# EAGLE design FootVibrator (EAGLE 9.5.1)

## Sheet 1 of 5: VL53L0X and Peripherals
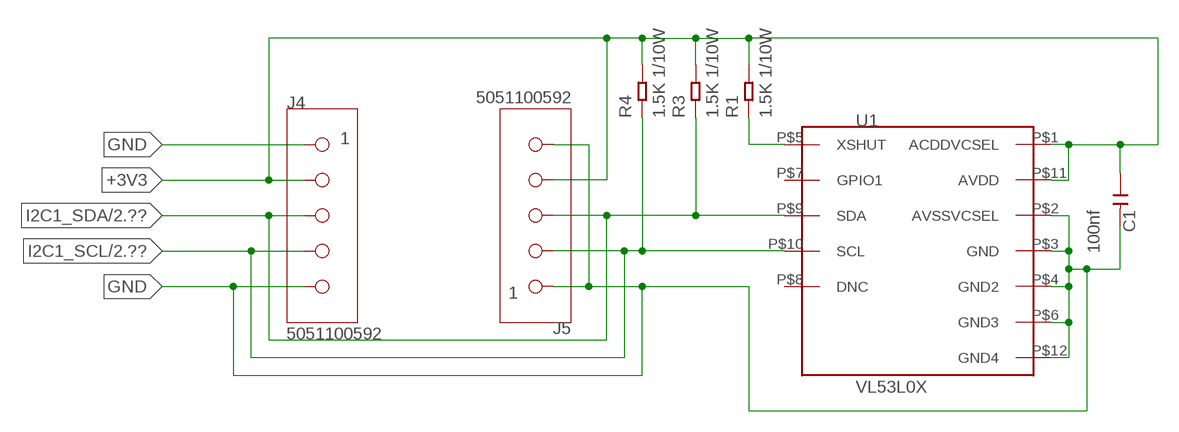
[diagram p0: schematic, sheet 1]

### Parts
C1  100nf  CERAMIC-100NF-50V-10%-X7R(0603)  [C0603]
J4  5051100592  [5051100592]
J5  5051100592  [5051100592]
R1  1.5K 1/10W  SMD-RES-1.5K-5%-1/10W(0603)  [R0603]
R3  1.5K 1/10W  SMD-RES-1.5K-5%-1/10W(0603)  [R0603]
R4  1.5K 1/10W  SMD-RES-1.5K-5%-1/10W(0603)  [R0603]
U1  VL53L0X  [VL53L0X]

### Nets
+3V3: C1.1 J4.2 J5.4 R1.2 R3.2 R4.2 U1.P$1(ACDDVCSEL) U1.P$11(AVDD) ; also sheet 2,3,4,5
GND: C1.2 J4.1 J4.5 J5.1 J5.5 U1.P$2(AVSSVCSEL) U1.P$3(GND) U1.P$4(GND2) U1.P$6(GND3) U1.P$12(GND4) ; also sheet 2,3,4,5
I2C1_SCL: J4.4 J5.2 R4.1 U1.P$10(SCL) ; also sheet 2
I2C1_SDA: J4.3 J5.3 R3.1 U1.P$9(SDA) ; also sheet 2
VL_XSHUT: R1.1 U1.P$5(XSHUT)
Unconnected: U1.P$7(GPIO1) U1.P$8(DNC)

## Sheet 2 of 5: STM32L010K8 and peripherals
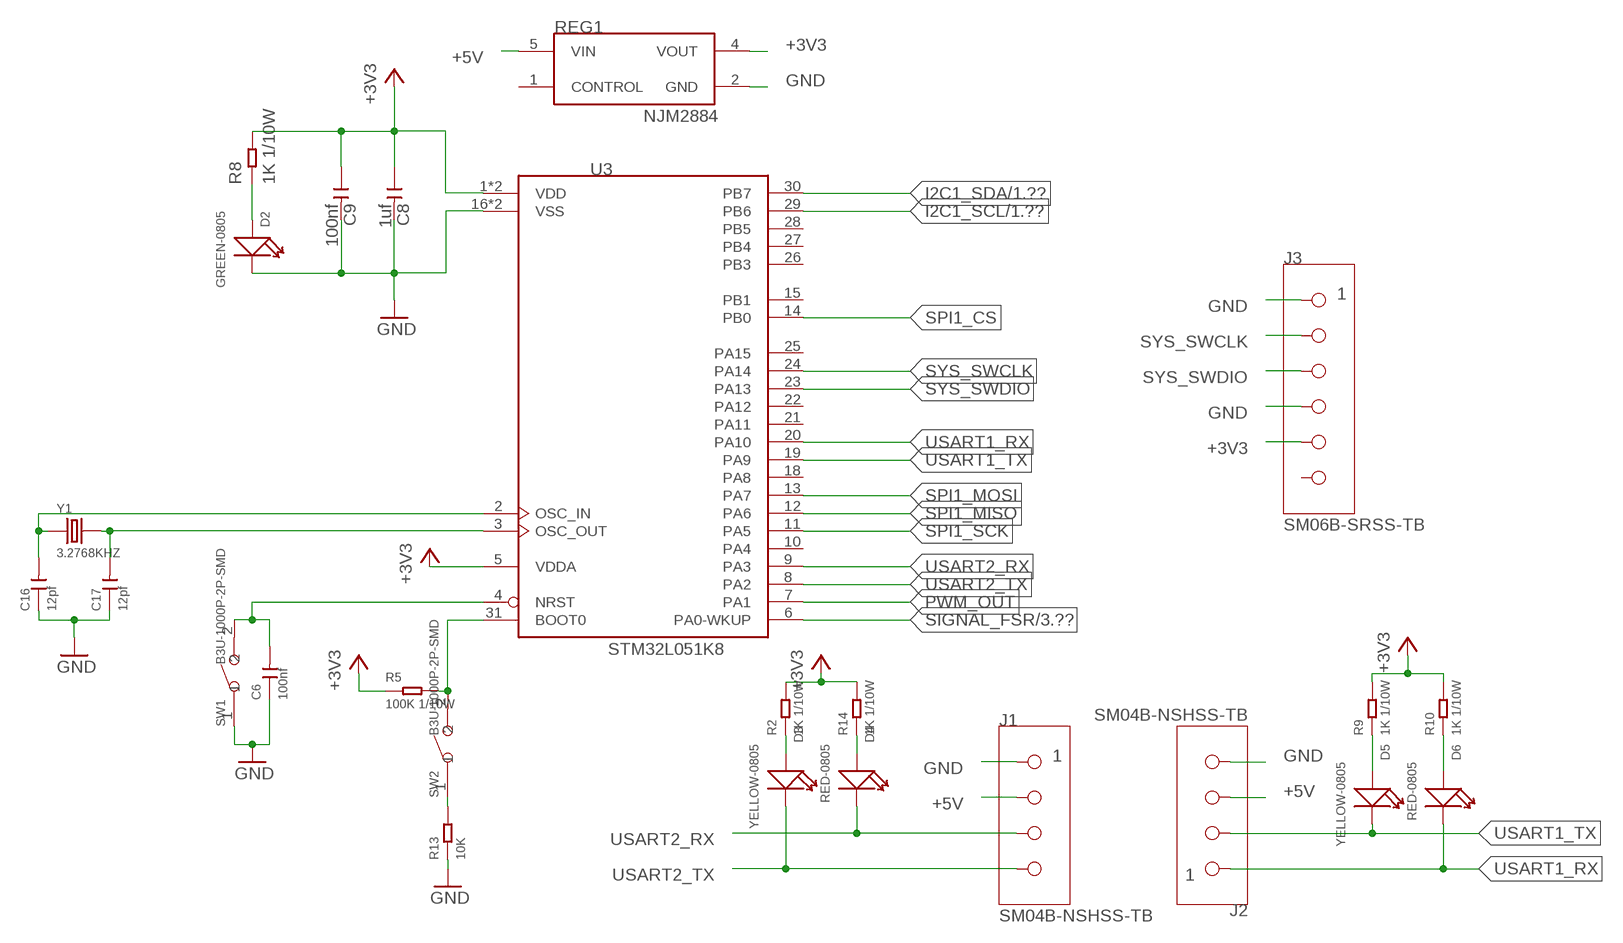
[diagram p1: schematic, sheet 2]

### Parts
C6  100nf  CERAMIC-100NF-50V-10%-X7R(0603)  [C0603]
C8  1uf  CERAMIC-1UF-25V-10%-X7R(0603)  [C0603]
C9  100nf  CERAMIC-100NF-50V-10%-X7R(0603)  [C0603]
C16  12pf  CERAMIC-12PF-50V-5%-NPO(0603)  [C0603]
C17  12pf  CERAMIC-12PF-50V-5%-NPO(0603)  [C0603]
D2  GREEN-0805  SMD-LED-CLEAR-GREEN(0805)  [LED-0805]
D3  YELLOW-0805  SMD-LED-CLEAR-YELLOW(0805)  [LED-0805]
D4  RED-0805  SMD-LED-CLEAR-RED(0805)  [LED-0805]
D5  YELLOW-0805  SMD-LED-CLEAR-YELLOW(0805)  [LED-0805]
D6  RED-0805  SMD-LED-CLEAR-RED(0805)  [LED-0805]
J1  SM04B-NSHSS-TB  [SM04B-NSHSS-TB]
J2  SM04B-NSHSS-TB  [SM04B-NSHSS-TB]
J3  SM06B-SRSS-TB  [SM06B-SRSS-TB]
R2  1K 1/10W  SMD-RES-1K-5%-1/10W(0603)  [R0603]
R5  100K 1/10W  SMD-RES-100K-5%-1/10W(0603)  [R0603]
R8  1K 1/10W  SMD-RES-1K-5%-1/10W(0603)  [R0603]
R9  1K 1/10W  SMD-RES-1K-5%-1/10W(0603)  [R0603]
R10  1K 1/10W  SMD-RES-1K-5%-1/10W(0603)  [R0603]
R13  10K  SMD-RES-10K-1%-1/10W(0603)  [R0603]
R14  1K 1/10W  SMD-RES-1K-5%-1/10W(0603)  [R0603]
REG1  NJM2884  [NJM2884-SOT-89-5]
SW1  B3U-1000P-2P-SMD  SMD-BUTTON(2P-3.0X2.5X1.2+0.4MM)-B3U-1000P-2P-SMD  [SW2-2.6-3.0X2.5X1.2+0.4MM]
SW2  B3U-1000P-2P-SMD  SMD-BUTTON(2P-3.0X2.5X1.2+0.4MM)-B3U-1000P-2P-SMD  [SW2-2.6-3.0X2.5X1.2+0.4MM]
U3  STM32L051K8  [LQFP32]
Y1  3.2768KHZ  SMD-CRYSTAL-32.768KHZ-12.5PF-20PPM-90K(2P-L2.0X1.2MM)  [X2-SMD-L2.0X1.2X0.55MM]

### Nets
+3V3: C8.1 C9.1 J3.5 R2.2 R5.1 R8.2 R9.2 R10.2 R14.2 REG1.4(VOUT) U3.1(VDD) U3.5(VDDA) U3.17(VDD) ; also sheet 1,3,4,5
+5V: J1.P$2 J2.P$3 REG1.5(VIN)
GND: C6.1 C8.2 C9.2 C16.1 C17.1 D2.- J1.P$1 J2.P$4 J3.1 J3.4 R13.1 REG1.2(GND) SW1.1 U3.16(VSS) U3.32(VSS) ; also sheet 1,3,4,5
I2C1_SCL: U3.29(PB6) ; also sheet 1
I2C1_SDA: U3.30(PB7) ; also sheet 1
N$1: R5.2 SW2.2 U3.31(BOOT0)
N$2: D3.+ R2.1
N$3: R13.2 SW2.1
N$7: D5.+ R9.1
N$8: D6.+ R10.1
N$9: D2.+ R8.1
N$11: C6.2 SW1.2 U3.4(NRST)
N$12: D4.+ R14.1
OCC_IN: C16.2 U3.2(OSC_IN) Y1.1
OCC_OUT: C17.2 U3.3(OSC_OUT) Y1.2
PWM_OUT: U3.7(PA1) ; also sheet 5
SIGNAL_FSR: U3.6(PA0-WKUP) ; also sheet 3
SPI1_CS: U3.14(PB0) ; also sheet 4
SPI1_MISO: U3.12(PA6) ; also sheet 4
SPI1_MOSI: U3.13(PA7) ; also sheet 4
SPI1_SCK: U3.11(PA5) ; also sheet 4
SYS_SWCLK: J3.2 U3.24(PA14)
SYS_SWDIO: J3.3 U3.23(PA13)
USART1_RX: D6.- J2.P$1 U3.20(PA10)
USART1_TX: D5.- J2.P$2 U3.19(PA9)
USART2_RX: D4.- J1.P$3 U3.9(PA3)
USART2_TX: D3.- J1.P$4 U3.8(PA2)
Unconnected: J3.6 REG1.1(CONTROL) U3.10(PA4) U3.15(PB1) U3.18(PA8) U3.21(PA11) U3.22(PA12) U3.25(PA15) U3.26(PB3) U3.27(PB4) U3.28(PB5)

## Sheet 3 of 5: FSR and Peripherals
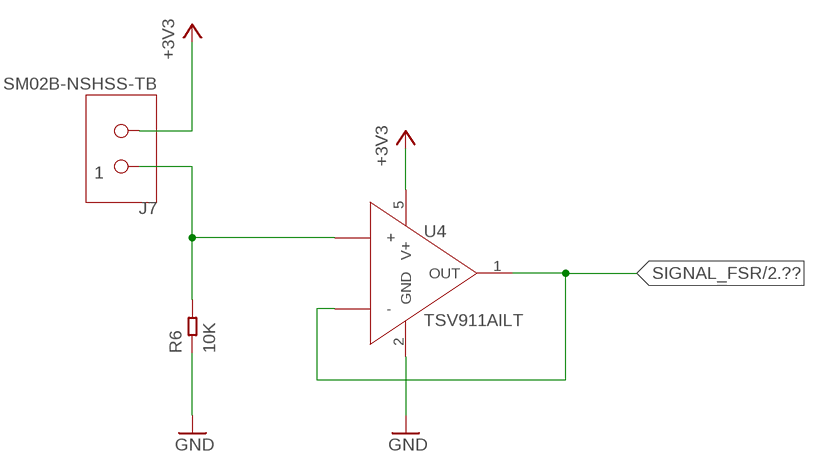
[diagram p2: schematic, sheet 3]

### Parts
J7  SM02B-NSHSS-TB  [SM02B-NSHSS-TB]
R6  10K  SMD-RES-10K-1%-1/10W(0603)  [R0603]
U4  TSV911AILT  [SOT23-5]

### Nets
+3V3: J7.P$2 U4.5(V+) ; also sheet 1,2,4,5
GND: R6.1 U4.2(GND) ; also sheet 1,2,4,5
RAW_FSR: J7.P$1 R6.2 U4.3(+)
SIGNAL_FSR: U4.1(OUT) U4.4(-) ; also sheet 2

## Sheet 4 of 5: IMU
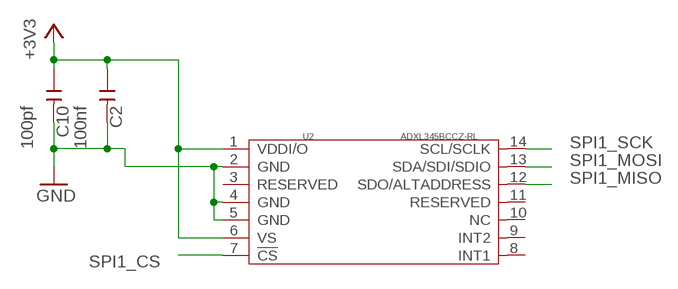
[diagram p3: schematic, sheet 4]

### Parts
C2  100nf  CERAMIC-100NF-50V-10%-X7R(0603)  [C0603]
C10  100pf  CERAMIC-100PF-50V-5%-NPO(0603)  [C0603]
U2  ADXL345BCCZ-RL  MOTION/POSITION-ADXL345BCCZ-RL(14P-5.0X3.0MM)  [LGA14-0.8-5.0X3.0MM]

### Nets
+3V3: C2.1 C10.1 U2.1(VDDI/O) U2.6(VS) ; also sheet 1,2,3,5
GND: C2.2 C10.2 U2.2(GND) U2.4(GND) U2.5(GND) ; also sheet 1,2,3,5
SPI1_CS: U2.7(!CS) ; also sheet 2
SPI1_MISO: U2.12(SDO/ALTADDRESS) ; also sheet 2
SPI1_MOSI: U2.13(SDA/SDI/SDIO) ; also sheet 2
SPI1_SCK: U2.14(SCL/SCLK) ; also sheet 2
Unconnected: U2.3(RESERVED) U2.8(INT1) U2.9(INT2) U2.10(NC) U2.11(RESERVED)

## Sheet 5 of 5: Vibrator
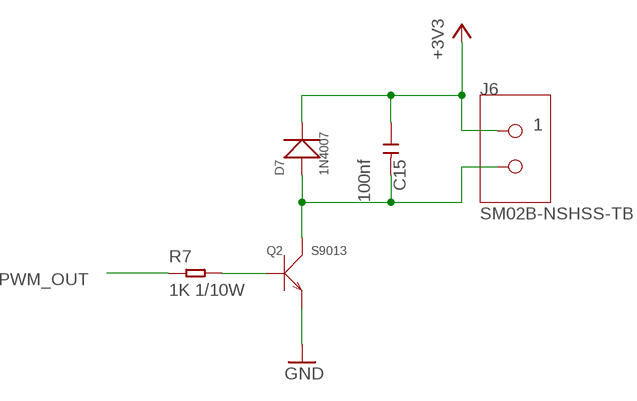
[diagram p4: schematic, sheet 5]

### Parts
C15  100nf  CERAMIC-100NF-50V-10%-X7R(0603)  [C0603]
D7  1N4007  DIODE-GEN-PURPOSE-1KV-1A(DO-214AC)  [DO-214AC]
J6  SM02B-NSHSS-TB  [SM02B-NSHSS-TB]
Q2  S9013  SMD-TRANSISTORS-NPN-25V-500MA-S9013(SOT-23)  [SOT-23]
R7  1K 1/10W  SMD-RES-1K-5%-1/10W(0603)  [R0603]

### Nets
+3V3: C15.1 D7.2(-) J6.P$1 ; also sheet 1,2,3,4
GND: Q2.2(E) ; also sheet 1,2,3,4
N$6: Q2.1(B) R7.2
PWM_OUT: R7.1 ; also sheet 2
RAW_MOTOR: C15.2 D7.1(+) J6.P$2 Q2.3(C)

## Library data of the parts
C1 C2 C6 C9 C15 = FootVibrator:CERAMIC-100NF-50V-10%-X7R(0603): 302010138; MPN: CC0603KRX7R9BB104
C8 = FootVibrator:CERAMIC-1UF-25V-10%-X7R(0603): 302010139; MPN: CC0603KRX7R8BB105
C10 = FootVibrator:CERAMIC-100PF-50V-5%-NPO(0603): 302010076; MPN: CC0603JRNPO9BN101
C16 C17 = FootVibrator:CERAMIC-12PF-50V-5%-NPO(0603): 302010067; MPN: CC0603JRNPO9BN120
D2 = FootVibrator:SMD-LED-CLEAR-GREEN(0805): 304090057; MPN: 17-215SYGC/S530-E2/TR8
D3 D5 = FootVibrator:SMD-LED-CLEAR-YELLOW(0805): 304090039; MPN: 17-215UYC/S530-A3/TR8
D4 D6 = FootVibrator:SMD-LED-CLEAR-RED(0805): 304090046; MPN: 17-215SURC/S530-A2/TR8
D7 = FootVibrator:DIODE-GEN-PURPOSE-1KV-1A(DO-214AC): 304010013; MPN: 1N4007
J1 J2 = FootVibrator:SM04B-NSHSS-TB
J3 = FootVibrator:SM06B-SRSS-TB
J4 J5 = FootVibrator:5051100592
J6 J7 = FootVibrator:SM02B-NSHSS-TB
Q2 = FootVibrator:SMD-TRANSISTORS-NPN-25V-500MA-S9013(SOT-23): 305010018; MPN: S9013
R1 R3 R4 = FootVibrator:SMD-RES-1.5K-5%-1/10W(0603): 301010114; MPN: RC0603JR-071K5L
R2 R7-R10 R14 = FootVibrator:SMD-RES-1K-5%-1/10W(0603): 301010291; MPN: RC0603JR-071KL
R5 = FootVibrator:SMD-RES-100K-5%-1/10W(0603): 301011975; MPN: RC0603JR-07100KL
R6 R13 = FootVibrator:SMD-RES-10K-1%-1/10W(0603): 301011970; MPN: RC0603FR-0710KL
REG1 = FootVibrator:NJM2884
SW1 SW2 = FootVibrator:SMD-BUTTON(2P-3.0X2.5X1.2+0.4MM): 311020047; MPN: B3U-1000P-2P-SMD
U1 = FootVibrator:VL53L0X
U2 = FootVibrator:MOTION/POSITION-ADXL345BCCZ-RL(14P-5.0X3.0MM): 314080008; MPN: ADXL345BCCZ-RL
U3 = FootVibrator:STM32L051K8
U4 = FootVibrator:TSV911AILT
Y1 = FootVibrator:SMD-CRYSTAL-32.768KHZ-12.5PF-20PPM-90K(2P-L2.0X1.2MM): 306010020; MPN: FC-12M

## Board
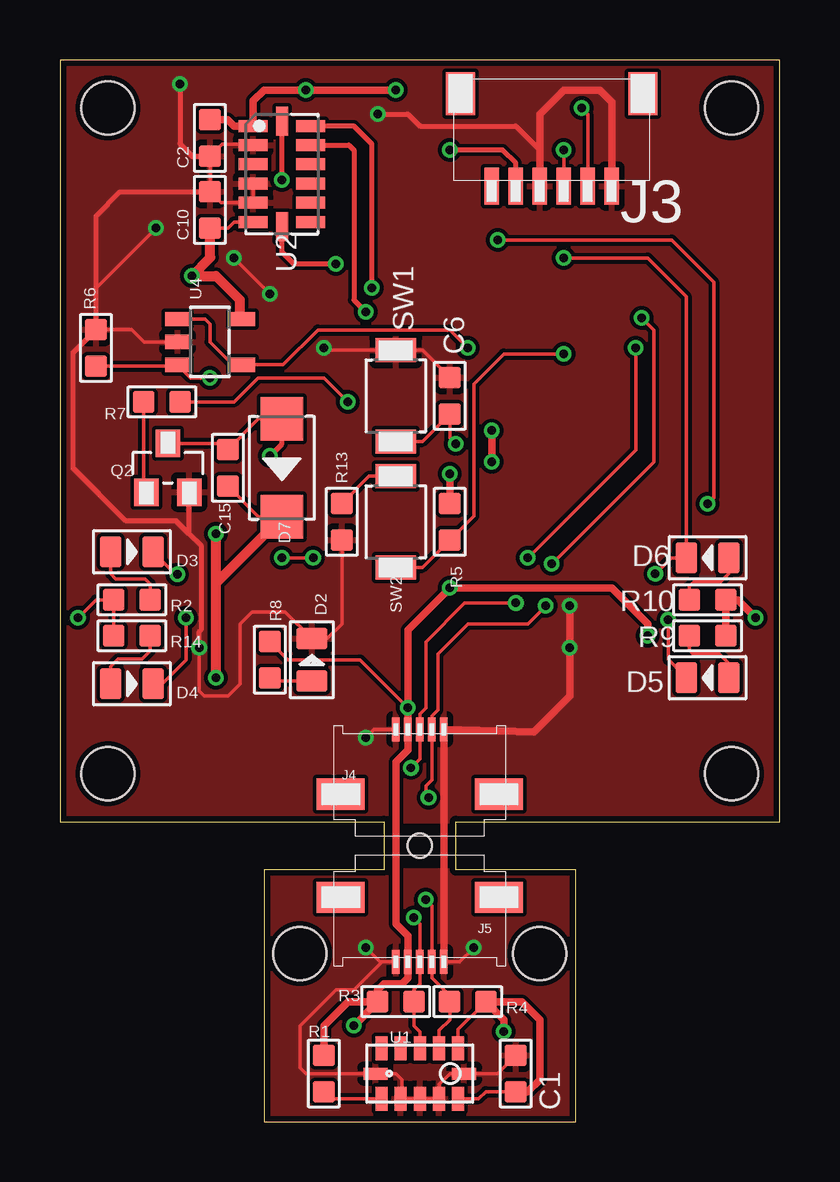
[diagram p5: board, top side]
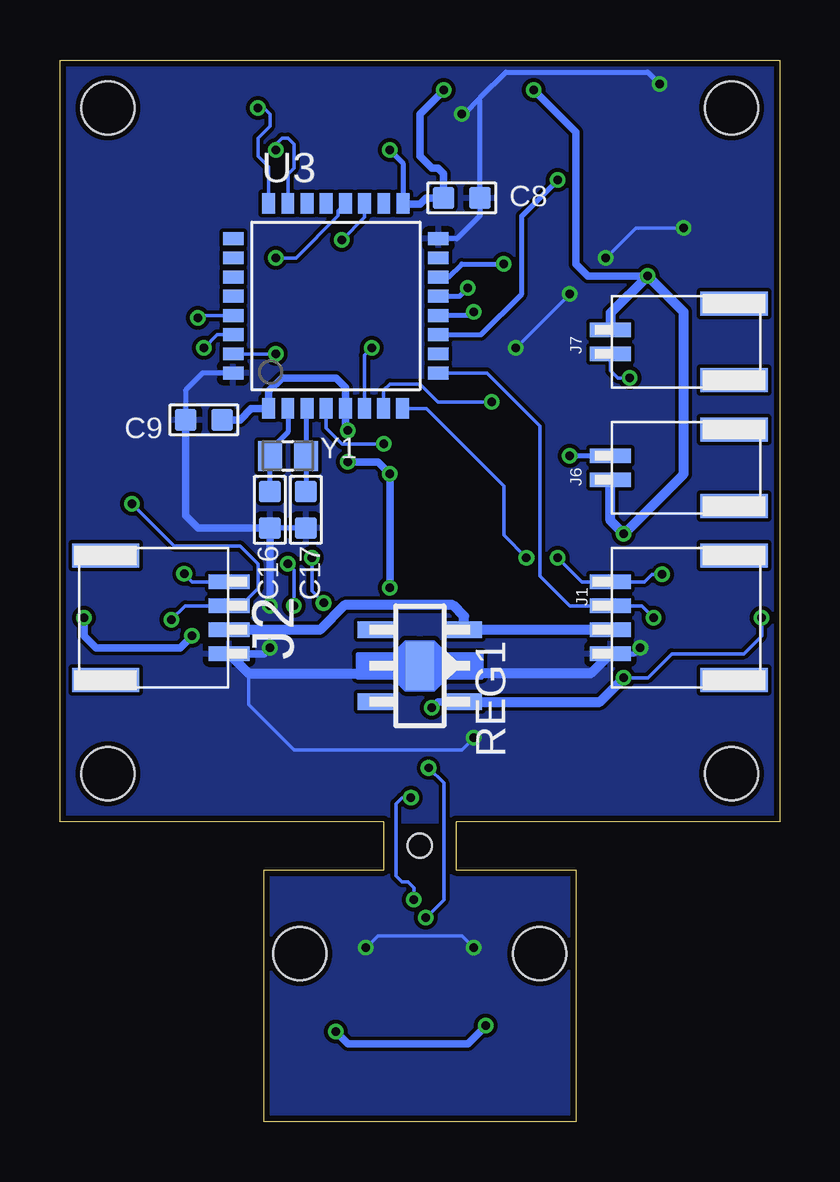
[diagram p6: board, bottom side, seen from below]

Size 30 x 44.25 mm. Coordinates in mm from the lower left corner, seen from the top.
Outline: 30,12.5 30,44.25 0,44.25 0,12.5 13.5,12.5 13.5,10.5 8.5,10.5 8.5,0 21.5,0 21.5,10.5 16.5,10.5 16.5,12.5 30,12.5
Copper layers (1*16): Top 0.035mm / dielectric 1.5mm / Bottom 0.035mm
Design rules "SeeedStudio_2layer_DRU_no_angle_20140221": minimum track width 6mil, minimum drill 12mil, track to track 6mil, track to pad 6mil, pad to pad 6mil, via to via 6mil, smd to smd 0mil, copper to edge 10mil, drill to drill 10mil, minimum pad ring 10mil, minimum via ring 6mil, stop-mask expansion 2mil, vias tented up to drill 100mil, thermal gap 10mil
Holes 2.2 mm at 10,7 20,7 2,14.5 28,14.5 28,42.25 2,42.25
Holes 1 mm at 15,11.5
tKeepout: area 0,12.5 to 4,16.5; area 26,12.5 to 30,16.5; area 26,40.2 to 30,44.2; area 0,40.2 to 4,44.2
bKeepout: area 26,12.5 to 30,16.5; area 0,12.5 to 4,16.5; area 0,40.2 to 4,44.2; area 26,40.2 to 30,44.2

### Footprints (pad centres in the part's own frame; a part is rotated, then mirrored left to right if it is on the bottom)
C0603 = smd 0.889 x 0.889: 1 0,0.762; 2 0,-0.762
LED-0805 = smd 0.889 x 1.27: + -0.889,0; - 0.889,0
DO-214AC = smd 1.8 x 1.77: 1 -2.042,0; 2 2.042,0
SM04B-NSHSS-TB = smd 1 x 2.8: NC 2.6,-1.4; NC2 -2.6,-1.4 | smd 0.6 x 1.7: P$1 1.5,-6.55; P$2 0.5,-6.55; P$3 -0.5,-6.55; P$4 -1.5,-6.55
SM06B-SRSS-TB = smd 0.6 x 1.55: 1 -2.5,4.755; 2 -1.5,4.755; 3 -0.5,4.755; 4 0.5,4.755; 5 1.5,4.755; 6 2.5,4.755 | smd 1.2 x 1.8: NC 3.8,0.9; NC2 -3.8,0.9
5051100592 = smd 0.3 x 1: 1 -1,3.35; 2 -0.5,3.35; 3 0,3.35; 4 0.5,3.35; 5 1,3.35 | smd 2 x 1.3: PMOUNT -3.3,0.65; PMOUNT_2 3.3,0.65
SM02B-NSHSS-TB = smd 1 x 2.8: NC 1.6,-1.4; NC2 -1.6,-1.4 | smd 0.6 x 1.7: P$1 0.5,-6.55; P$2 -0.5,-6.55
SOT-23 = smd 1.016 x 1.143: 1 -0.889,-1.016; 2 0.889,-1.016; 3 0,1.016
R0603 = smd 0.889 x 0.889: 1 0,0.762; 2 0,-0.762
NJM2884-SOT-89-5 = smd 0.7 x 1.5: 1 -1.5,-1.85; 3 1.5,-1.85; 4 1.5,1.85; 5 -1.5,1.85 | smd 2 x 1.2: 2 0,0
SW2-2.6-3.0X2.5X1.2+0.4MM = smd 1 x 1.7: 1 -1.9,0; 2 1.9,0
VL53L0X = smd 0.5 x 1: P$1 1.6,-1.05; P$2 0.8,-1.05; P$3 0,-1.05; P$4 -0.8,-1.05; P$5 -1.6,-1.05; P$7 -1.6,1.05; P$8 -0.8,1.05; P$9 0,1.05; P$10 0.8,1.05; P$11 1.6,1.05 | smd 1 x 0.5: P$6 -1.85,0; P$12 1.85,0
LGA14-0.8-5.0X3.0MM = smd 1.2 x 0.5: 1 -1.2,2; 2 -1.2,1.2; 3 -1.2,0.4; 4 -1.2,-0.4; 5 -1.2,-1.2; 6 -1.2,-2; 8 1.2,-2; 9 1.2,-1.2; 10 1.2,-0.4; 11 1.2,0.4; 12 1.2,1.2; 13 1.2,2 | smd 0.5 x 1.2: 7 0,-2.2; 14 0,2.2
LQFP32 = smd 0.54 x 0.85: 1 -2.8,-4.275; 2 -2,-4.275; 3 -1.2,-4.275; 4 -0.4,-4.275; 5 0.4,-4.275; 6 1.19,-4.275; 7 1.99,-4.275; 8 2.79,-4.275; 17 2.8,4.275; 18 2,4.275; 19 1.2,4.275; 20 0.4,4.275; 21 -0.4,4.275; 22 -1.2,4.275; 23 -2,4.275; 24 -2.8,4.275 | smd 0.85 x 0.54: 9 4.275,-2.8; 10 4.275,-2; 11 4.275,-1.2; 12 4.275,-0.4; 13 4.275,0.4; 14 4.275,1.2; 15 4.275,2; 16 4.275,2.8; 25 -4.275,2.8; 26 -4.275,2; 27 -4.275,1.2; 28 -4.275,0.4; 29 -4.275,-0.4; 30 -4.275,-1.2; 31 -4.275,-2; 32 -4.275,-2.8
SOT23-5 = smd 0.6 x 1.05: 1 -0.95,-1.35; 2 0,-1.35; 3 0.95,-1.35; 4 0.95,1.35; 5 -0.95,1.35
X2-SMD-L2.0X1.2X0.55MM = smd 1 x 1.25: 1 -0.75,0; 2 0.75,0

### Placement (x,y rotation side)
C1  19,2 180 top
C2  6.25,41 0 top
C6  16.25,30.25 0 top
C8  13.25,38.5 90 bottom
C9  24,29.25 270 bottom
C10  6.25,38 180 top
C15  7,27.25 180 top
C16  21.25,25.5 180 bottom
C17  19.75,25.5 180 bottom
D2  10.5,19.25 90 top
D3  3,23.75 0 top
D4  3,18.25 0 top
D5  27,18.5 180 top
D6  27,23.5 180 top
D7  9.25,27.25 270 top
J1  0.5,21 270 bottom
J2  29.5,21 90 bottom
J3  20.5,43.75 180 top
J4  15,13 0 top
J5  15,10 180 top
J6  0.5,27.25 270 bottom
J7  0.5,32.5 270 bottom
Q2  4.5,27.25 0 top
R1  11,2 180 top
R2  3,21.75 270 top
R3  14,5 270 top
R4  17,5 90 top
R5  16.25,25 0 top
R6  1.5,32.25 0 top
R7  4.25,30 270 top
R8  8.75,19.25 180 top
R9  27,20.25 90 top
R10  27,21.75 90 top
R13  11.75,25 180 top
R14  3,20.25 270 top
REG1  15,19 270 bottom
SW1  14,30.25 270 top
SW2  14,25 270 top
U1  15,2 0 top
U2  9.25,39.5 0 top
U3  18.5,34 0 bottom
U4  6.25,32.5 270 top
Y1  20.5,27.75 0 bottom

### Tracks (layer width: path | path; a pad name or v marks a point on that pad's centre or on a via)
+3V3  (via drill 0.35)
  Top 0.152: U1.P$11 16.6,3.85 R4.2 | U1.P$1 17.45,0.95 17.75,1.25 18.99,1.25 C1.1 | C10.1 6.26,37.25 7,37.25 7.25,37.5 U2.6 | v0.75,21 1.5,21.75 R2.2 R14.2 | C15.1 8.28,25.21 D7.2 | R8.2 9.51,19.25 12.5,19.25 v14.5,17.25
  Top 0.203: J3.5 19,39.95 18.45,40.5 v16.25,40.5
  Top 0.305: R4.2 19.25,5 20,4.25 20,1.75 19.49,1.24 C1.1 | R3.2 13.24,5.49 13.5,5.75 14.25,5.75 14.5,6 J5.4 14.5,7.75 14,8.25 14,15 14.5,15.5 J4.2 v14.5,17.25 14.5,20.5 v16.25,22.25 23,22.25 24.5,20.75 v24.5,20.25 | R3.2 12,5 11,4 R1.2 | R3.2 13.24,4.99 v12.25,4 | v18.5,3.75 18.5,4.25 R4.2 | R9.2 R10.2 28.25,21.75 v29,21 | v16.25,27 R5.1 | v18,27.5 v18,28.81 | v14,43 v10.25,43 8.5,43 8.05,42.55 U2.1 7.25,41.5 6.99,41.76 C2.1
  Top 0.406: v6.5,18.5 6.5,22.46 | 6.5,22.46 D7.2 | 6.5,22.46 v6.5,24.5 | 6.26,37.25 6.26,36.01 v5.5,35.25 6.5,35.25 7.5,34.25 7.5,33.55 U4.5
  Bottom 0.152: 15.68,38.25 U3.17 | v6.5,18.5 5.5,18.5 4.5,19.5 1.5,19.5 0.75,20.25 v0.75,21
  Bottom 0.203: v16.25,40.5 15.7,39.95 U3.17
  Bottom 0.305: v12.25,4 13,3.25 18,3.25 v18.5,3.75 | REG1.4 14.25,17.5 v14.5,17.25 | v16.25,22.25 v16.25,27 16.75,27.5 v18,27.5 | v18,28.81 18.1,28.91 U3.5 18.1,30.6 18.5,31 20.75,31 21.3,30.45 U3.1 22.02,29.73 22.5,29.25 C9.1 | v24.5,20.25 25,19.75 28.5,19.75 29,20.25 v29,21 | 15.68,38.25 15,38.25 14.75,38.5 C8.1 14.01,39.51 14.25,39.75 14.5,39.75 15,40.25 15,42 v14,43 | v5.5,35.25 8,35.25 8.5,35.75 8.5,41.25 v10.25,43
  Bottom 0.406: REG1.4 7.5,17.5 v6.5,18.5 | J6.P$1 7.05,25.05 v6.5,24.5 4,27 4,33.75 v5.5,35.25 7.05,33.7 J7.P$2
+5V
  Bottom 0.406: J1.P$2 REG1.5 13.15,21.06 13.62,21.53 18.13,21.53 19.16,20.5 J2.P$3
GND  (via drill 0.35)
  Top 0.152: C1.2 18.24,2 U1.P$12 16.25,2 15.8,1.55 U1.P$2 U1.P$3 U1.P$4 14.25,1 14.25,1.75 14,2 U1.P$6 10.25,2 10,2.25 10,4 11.5,5.5 12.25,5.5 13.38,6.62 | U2.2 8,40.75 6.76,40.75 C2.2 C10.2 6.71,38.3 U2.5 U2.4 | R6.1 2.99,33.01 3.5,32.5 U4.2 | C6.1 15.11,32.15 SW1.1 11.1,32.15 v11,32.25 | R13.1 11.75,20.75 11.14,20.14 D2.- 9.39,21.25 8,21.25 7.5,20.75 7.5,18.25 7,17.75 6,17.75 5.81,17.94 v5.81,19.75 | v8.75,34.5 v7.25,36 | v4,37.25 1.5,34.75 1.5,34.5 | 13.38,6.62 13.4,6.65 J5.5 | 13.38,6.62 v12.75,7.25 | J5.1 16.65,6.65 v17.25,7.25 | v12.75,16 13.1,16.35 J4.1
  Top 0.203: v5.81,19.75 5.81,20.43 5.9,20.52 5.9,23.98 5.39,24.49 5.39,24.5 | 5.39,24.5 Q2.2 | 5.39,24.5 4.85,25.04 2.74,25.04 0.55,27.23 0.55,32.06 R6.1 1.5,34.5 1.5,37.75 2.51,38.76 C10.2 | v5,43.25 5,40.75 5.51,40.24 C2.2 | v13.25,42 14.5,42 15,41.5 19,41.5 20,40.5
  Top 0.305: J5.1 J4.5 19.75,16.25 21.25,17.75 v21.25,19.75 v21.25,21.5 | J3.4 20,40.5 20,42 21,43 22.5,43 23,42.5 J3.1
  Bottom 0.152: v17.25,7.25 16.75,7.75 13.25,7.75 v12.75,7.25 | v12.75,16 13.25,15.5 20.25,15.5 22.13,17.38 22.13,18.68 | v11,32.25 v8.75,34.5 | v7.25,36 6,37.25 v4,37.25
  Bottom 0.203: J1.P$1 6.06,19.5 v5.81,19.75 | 12.49,42.67 C8.2 12.49,37.76 13.45,36.8 U3.16 | v5,43.25 5.5,43.75 11.41,43.75 12.49,42.67 | 12.49,42.67 13.16,42 v13.25,42 | U3.32 24.05,31.2 24.76,30.49 C9.2 | C17.1 C16.1
  Bottom 0.305: J2.P$4 21.5,19.5 v21.25,19.75 | v21.25,21.5 C16.1 24.24,24.74 24.76,25.26 C9.2
  Bottom 0.406: J1.P$1 7.87,18.68 14.68,18.68 | 14.68,18.68 REG1.2 | J2.P$4 22.13,18.68 14.68,18.68
  pour Top: 8.5,10.5 21.5,10.5 21.5,0 8.5,0
  pour Bottom: 8.5,10.5 21.5,10.5 21.5,0 8.5,0
  pour Bottom: 0,12.5 30,12.5 30,44.25 0,44.25
  pour Top: 0,12.5 30,12.5 30,44.25 0,44.25
I2C1_SCL  (via drill 0.35)
  Top 0.152: U1.P$10 15.8,3.8 16.25,4.25 16.25,4.99 R4.1 16.24,5.26 15.5,6 J5.2 15.5,9 v15.25,9.25 | v15.37,13.5 15.25,13.62 15.25,14 15.5,14.25 J4.4 15.5,16.9 15.75,17.15 15.75,19.5 17,20.75 19.5,20.75 v20.25,21.5 | v20.5,23.25 24.75,27.5 24.75,33 v24.25,33.5
  Bottom 0.152: v15.25,9.25 15.25,9.75 15.5,10 15.75,10 16,10.25 16,13.25 15.75,13.5 v15.37,13.5 | v20.25,21.5 20.25,23 v20.5,23.25 | v24.25,33.5 24.15,33.6 U3.29
I2C1_SDA  (via drill 0.35)
  Top 0.152: U1.P$9 15,3.75 14.75,4 14.75,4.99 R3.1 14.76,5.51 15,5.75 J5.3 15,8.25 v14.75,8.5 | v14.63,14.74 15,15.11 J4.3 15,17 15.25,17.25 15.25,20 16.87,21.62 v19.01,21.62 | v19.5,23.5 24,28 v24,32.25
  Bottom 0.152: v14.63,14.74 14,14.11 14,9.25 v14.75,8.5 | v19.01,21.62 19.5,22.11 v19.5,23.5 | v24,32.25 23.45,32.8 U3.30
N$1  (via drill 0.35)
  Top 0.152: SW2.2 15.11,23.1 R5.2 17.25,25.24 17.25,30.75 18.5,32 v21,32
  Bottom 0.152: v21,32 U3.31
N$2
  Top 0.152: R2.1 3.76,22.41 3.55,22.62 2.33,22.62 2.11,22.84 D3.+
N$3
  Top 0.152: R13.2 12.89,26.9 SW2.1
N$6
  Top 0.152: Q2.1 3.49,26.36 R7.2
N$7
  Top 0.152: R9.1 26.24,19.65 26.39,19.5 27.49,19.5 27.89,19.1 D5.+
N$8
  Top 0.152: R10.1 26.24,22.31 26.43,22.5 27.54,22.5 27.89,22.85 D6.+
N$9
  Top 0.152: R8.1 8.88,18.36 D2.+
N$11  (via drill 0.35)
  Top 0.152: SW1.2 15.11,28.35 C6.2 16.25,28.5 v16.5,28.25
  Bottom 0.152: U3.4 18.9,28.9 18.25,28.25 v16.5,28.25
N$12
  Top 0.152: D4.+ 2.11,18.97 2.43,19.29 3.43,19.29 3.76,19.62 R14.1
OCC_IN
  Bottom 0.203: U3.2 20.5,28.75 21.25,28 Y1.1 C16.2
OCC_OUT
  Bottom 0.203: U3.3 19.75,29.68 Y1.2 C17.2
PWM_OUT  (via drill 0.35)
  Top 0.152: v12,30 11,31 8.25,31 7.25,30 R7.1
  Bottom 0.152: U3.7 16.51,30.49 16.25,30.75 15,30.75 14.25,30 v12,30
RAW_FSR  (via drill 0.35)
  Top 0.152: R6.2 4.84,31.49 U4.3 5.45,31 v6.25,31
  Bottom 0.152: J7.P$1 7.05,31.3 6.75,31 v6.25,31
RAW_MOTOR  (via drill 0.35)
  Top 0.152: D7.1 8.28,29.29 C15.2 6.75,28.27 Q2.3
  Top 0.203: v8.75,27.75 9.25,28.25 D7.1
  Bottom 0.203: J6.P$2 v8.75,27.75
SIGNAL_FSR  (via drill 0.35)
  Top 0.152: v17,32.25 16.25,33 10.75,33 9.3,31.55 U4.4 7.2,31.55 6.25,32.5 6.25,33.25 6.05,33.45 U4.1
  Bottom 0.152: v17,32.25 17.31,31.94 U3.6
SPI1_CS  (via drill 0.35)
  Top 0.203: v11.5,35.75 9.75,35.75 9.25,36.25 U2.7
  Bottom 0.203: U3.14 13.8,35.2 13.25,35.75 v11.5,35.75
SPI1_MISO  (via drill 0.35)
  Top 0.203: U2.12 12.05,40.7 12.25,40.5 12.25,34.25 v12.75,33.75
  Bottom 0.203: v12.75,33.75 12.9,33.6 U3.12
SPI1_MOSI  (via drill 0.35)
  Top 0.203: U2.13 12.25,41.5 13,40.75 v13,34.75
  Bottom 0.203: U3.13 13.35,34.4 v13,34.75
SPI1_SCK  (via drill 0.35)
  Top 0.203: v9.25,39.25 U2.14
  Bottom 0.203: U3.11 12.45,32.8 10.75,34.5 10.75,37.75 v9.25,39.25
SYS_SWCLK  (via drill 0.35)
  Top 0.152: v21.75,42.25 22,42 J3.2
  Bottom 0.152: U3.24 21.3,39.8 21.75,40.25 21.75,41 21.25,41.5 21.25,42 21.5,42.25 v21.75,42.25
SYS_SWDIO  (via drill 0.35)
  Top 0.152: J3.3 v21,40.5
  Bottom 0.152: v21,40.5 21,40.75 20.75,41 20.5,41 20.25,40.75 20.25,39.75 20.5,39.5 U3.23
USART1_RX  (via drill 0.35)
  Top 0.152: v24.82,22.83 25.49,23.5 D6.- 26.11,34.39 24.5,36 v21,36
  Bottom 0.152: J2.P$1 24.49,22.5 v24.82,22.83 | U3.20 18.4,37.97 18.4,37.76 20.16,36 v21,36
USART1_TX  (via drill 0.35)
  Top 0.152: D5.- 25.36,19.25 v25.36,20.92 | v18.25,36.75 25.5,36.75 27.25,35 27.25,26 v27,25.75
  Bottom 0.152: v25.36,20.92 24.78,21.5 J2.P$2 22.48,21.5 21.75,22.23 21.75,23.25 22.5,24 25.25,24 v27,25.75 | U3.19 17.3,37.7 v18.25,36.75
USART2_RX  (via drill 0.35)
  Top 0.152: v5.25,21 5.25,19.25 4.25,18.25 D4.-
  Bottom 0.152: v5.25,21 5.75,21.5 J1.P$3 8.75,21.5 10,22.75 10,29 12.2,31.2 U3.9
USART2_TX  (via drill 0.35)
  Top 0.152: D3.- 4.83,22.81 v4.89,22.81 | v9.25,23.5 v10.56,23.5
  Bottom 0.152: v4.89,22.81 5.33,22.81 5.64,22.5 J1.P$4 8.25,22.5 v9.25,23.5 | v10.56,23.5 11.5,24.44 11.5,26.5 14.72,29.73 U3.8
VL_XSHUT
  Top 0.152: U1.P$5 11.29,0.95 R1.1

### Text on the board
tDocu: JSK Vibrator v1